# EAGLE schematic c3 (EAGLE 8.7.1)
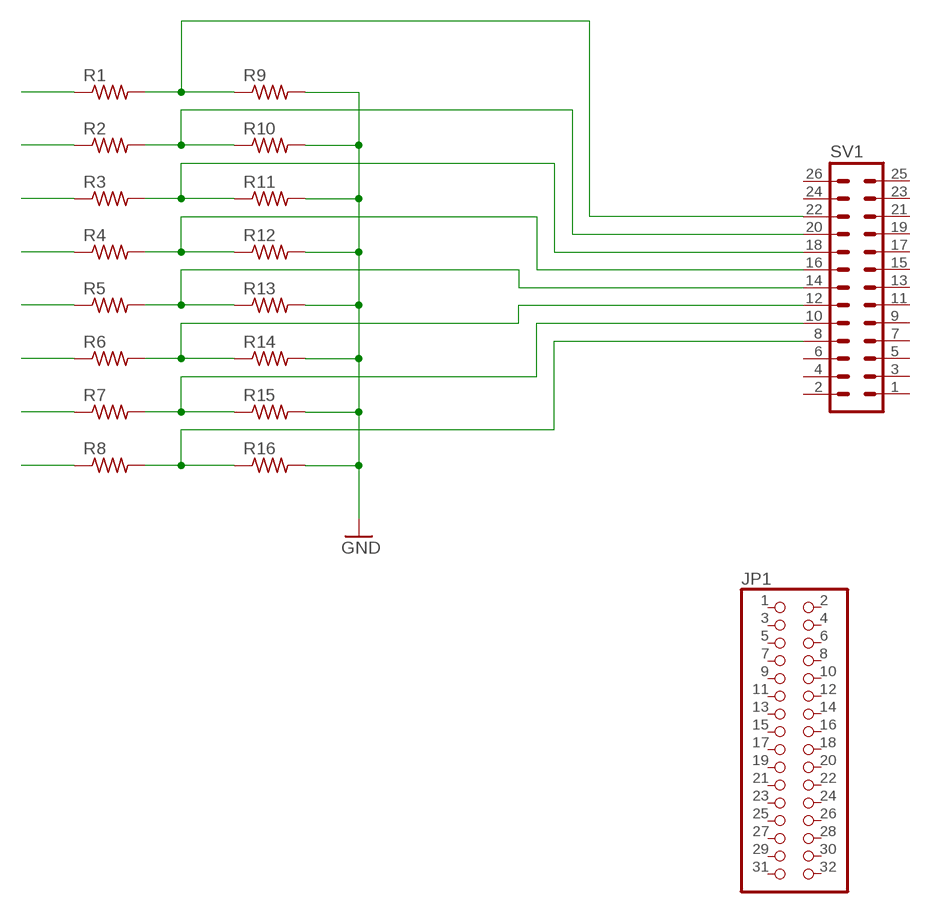
[diagram p0: schematic, sheet 1]

## Parts
JP1  PINHD-2X16  [2X16]
R1  R-US_0204/7  [0204/7]
R2  R-US_0204/7  [0204/7]
R3  R-US_0204/7  [0204/7]
R4  R-US_0204/7  [0204/7]
R5  R-US_0204/7  [0204/7]
R6  R-US_0204/7  [0204/7]
R7  R-US_0204/7  [0204/7]
R8  R-US_0204/7  [0204/7]
R9  R-US_0204/7  [0204/7]
R10  R-US_0204/7  [0204/7]
R11  R-US_0204/7  [0204/7]
R12  R-US_0204/7  [0204/7]
R13  R-US_0204/7  [0204/7]
R14  R-US_0204/7  [0204/7]
R15  R-US_0204/7  [0204/7]
R16  R-US_0204/7  [0204/7]
SV1  MA13-2  [MA13-2]

## Nets
GND: R9.2 R10.2 R11.2 R12.2 R13.2 R14.2 R15.2 R16.2
N$1: R2.1
N$2: R1.2 R9.1 SV1.22
N$3: R2.2 R10.1 SV1.20
N$4: R3.2 R11.1 SV1.18
N$5: R4.2 R12.1 SV1.16
N$6: R5.2 R13.1 SV1.14
N$7: R6.2 R14.1 SV1.12
N$8: R7.2 R15.1 SV1.10
N$9: R8.2 R16.1 SV1.8
N$10: R1.1
N$11: R3.1
N$12: R4.1
N$13: R5.1
N$14: R6.1
N$15: R7.1
N$16: R8.1
Unconnected: JP1.1 JP1.2 JP1.3 JP1.4 JP1.5 JP1.6 JP1.7 JP1.8 JP1.9 JP1.10 JP1.11 JP1.12 JP1.13 JP1.14 JP1.15 JP1.16 JP1.17 JP1.18 JP1.19 JP1.20 JP1.21 JP1.22 JP1.23 JP1.24 JP1.25 JP1.26 JP1.27 JP1.28 JP1.29 JP1.30 JP1.31 JP1.32 SV1.1 SV1.2 SV1.3 SV1.4 SV1.5 SV1.6 SV1.7 SV1.9 SV1.11 SV1.13 SV1.15 SV1.17 SV1.19 SV1.21 SV1.23 SV1.24 SV1.25 SV1.26

## Library data of the parts
JP1 = pinhead:PINHD-2X16: PIN HEADER
R1-R16 = resistor:R-US_: RESISTOR, American symbol
SV1 = con-lstb:MA13-2: PIN HEADER; OC_FARNELL: unknown; OC_NEWARK: unknown